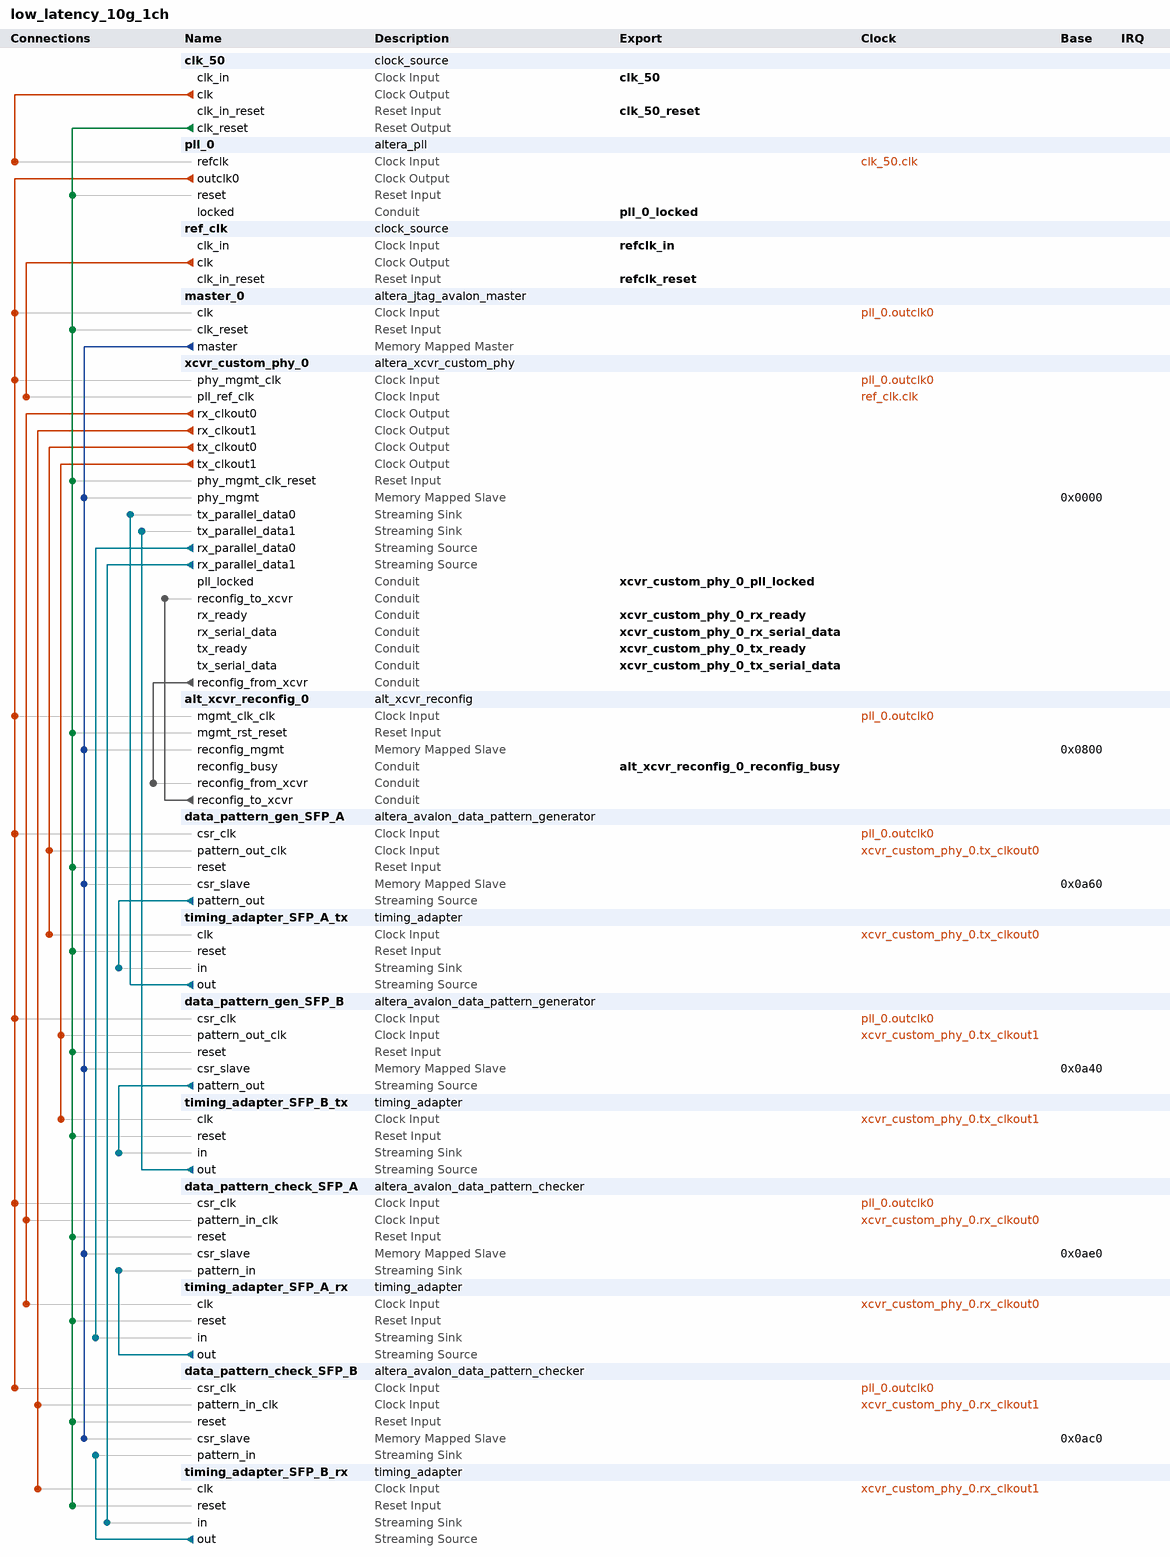
[diagram p0: system contents]
# Platform Designer (Qsys) system low_latency_10g_1ch, Arria V 5AGTFC7H3F35I3
# Parameters at their usual value, and those the tool derives, are not listed.
package require -exact qsys 17.1
create_system low_latency_10g_1ch
set_project_property DEVICE_FAMILY {Arria V}
set_project_property DEVICE 5AGTFC7H3F35I3

add_instance clk_50 clock_source 17.1
set_instance_parameter_value clk_50 clockFrequency 50000000

add_instance pll_0 altera_pll 17.1
set_instance_parameter_value pll_0 gui_device_speed_grade 1
set_instance_parameter_value pll_0 gui_number_of_clocks 1
set_instance_parameter_value pll_0 gui_operation_mode normal
set_instance_parameter_value pll_0 gui_output_clock_frequency0 100.0
set_instance_parameter_value pll_0 gui_pll_mode {Integer-N PLL}
set_instance_parameter_value pll_0 gui_reference_clock_frequency 50.0
set_instance_parameter_value pll_0 gui_use_locked true

add_instance ref_clk clock_source 17.1
set_instance_parameter_value ref_clk clockFrequency 156250000

add_instance master_0 altera_jtag_avalon_master 17.1

add_instance xcvr_custom_phy_0 altera_xcvr_custom_phy 17.1
set_instance_parameter_value xcvr_custom_phy_0 byte_order_pad_pattern 000000000
set_instance_parameter_value xcvr_custom_phy_0 byte_order_pattern 111111011
set_instance_parameter_value xcvr_custom_phy_0 channel_interface 0
set_instance_parameter_value xcvr_custom_phy_0 coreclk_0ppm_enable false
set_instance_parameter_value xcvr_custom_phy_0 data_rate 6250Mbps
set_instance_parameter_value xcvr_custom_phy_0 device_family {Arria V}
set_instance_parameter_value xcvr_custom_phy_0 en_synce_support 0
set_instance_parameter_value xcvr_custom_phy_0 gui_base_data_rate {10312.5 Mbps}
set_instance_parameter_value xcvr_custom_phy_0 gui_bonded_mode xN
set_instance_parameter_value xcvr_custom_phy_0 gui_bonding_enable false
set_instance_parameter_value xcvr_custom_phy_0 gui_byte_order_pld_ctrl_enable false
set_instance_parameter_value xcvr_custom_phy_0 gui_deser_factor 40
set_instance_parameter_value xcvr_custom_phy_0 gui_embedded_reset 1
set_instance_parameter_value xcvr_custom_phy_0 gui_enable_run_length false
set_instance_parameter_value xcvr_custom_phy_0 gui_mgmt_clk_in_hz 250000000
set_instance_parameter_value xcvr_custom_phy_0 gui_parameter_rules Custom
set_instance_parameter_value xcvr_custom_phy_0 gui_pcs_pma_width PARAM_DEFAULT
set_instance_parameter_value xcvr_custom_phy_0 gui_pll_reconfig_cdr_pll_refclk_sel 0
set_instance_parameter_value xcvr_custom_phy_0 gui_pll_reconfig_enable_pll_reconfig false
set_instance_parameter_value xcvr_custom_phy_0 gui_pll_reconfig_main_pll_index 0
set_instance_parameter_value xcvr_custom_phy_0 gui_pll_reconfig_pll0_clk_network x1
set_instance_parameter_value xcvr_custom_phy_0 gui_pll_reconfig_pll0_data_rate {0 Mbps}
set_instance_parameter_value xcvr_custom_phy_0 gui_pll_reconfig_pll0_pll_type CMU
set_instance_parameter_value xcvr_custom_phy_0 gui_pll_reconfig_pll0_refclk_freq {0 MHz}
set_instance_parameter_value xcvr_custom_phy_0 gui_pll_reconfig_pll0_refclk_sel 0
set_instance_parameter_value xcvr_custom_phy_0 gui_pll_reconfig_pll1_clk_network x1
set_instance_parameter_value xcvr_custom_phy_0 gui_pll_reconfig_pll1_data_rate {0 Mbps}
set_instance_parameter_value xcvr_custom_phy_0 gui_pll_reconfig_pll1_pll_type CMU
set_instance_parameter_value xcvr_custom_phy_0 gui_pll_reconfig_pll1_refclk_freq {0 MHz}
set_instance_parameter_value xcvr_custom_phy_0 gui_pll_reconfig_pll1_refclk_sel 0
set_instance_parameter_value xcvr_custom_phy_0 gui_pll_reconfig_pll2_clk_network x1
set_instance_parameter_value xcvr_custom_phy_0 gui_pll_reconfig_pll2_data_rate {0 Mbps}
set_instance_parameter_value xcvr_custom_phy_0 gui_pll_reconfig_pll2_pll_type CMU
set_instance_parameter_value xcvr_custom_phy_0 gui_pll_reconfig_pll2_refclk_freq {0 MHz}
set_instance_parameter_value xcvr_custom_phy_0 gui_pll_reconfig_pll2_refclk_sel 0
set_instance_parameter_value xcvr_custom_phy_0 gui_pll_reconfig_pll3_clk_network x1
set_instance_parameter_value xcvr_custom_phy_0 gui_pll_reconfig_pll3_data_rate {0 Mbps}
set_instance_parameter_value xcvr_custom_phy_0 gui_pll_reconfig_pll3_pll_type CMU
set_instance_parameter_value xcvr_custom_phy_0 gui_pll_reconfig_pll3_refclk_freq {0 MHz}
set_instance_parameter_value xcvr_custom_phy_0 gui_pll_reconfig_pll3_refclk_sel 0
set_instance_parameter_value xcvr_custom_phy_0 gui_pll_reconfig_pll_count 1
set_instance_parameter_value xcvr_custom_phy_0 gui_pll_reconfig_refclk_count 1
set_instance_parameter_value xcvr_custom_phy_0 gui_pll_refclk_freq {156.25 MHz}
set_instance_parameter_value xcvr_custom_phy_0 gui_pll_type CMU
set_instance_parameter_value xcvr_custom_phy_0 gui_pma_bonding_mode x1
set_instance_parameter_value xcvr_custom_phy_0 gui_rx_use_coreclk false
set_instance_parameter_value xcvr_custom_phy_0 gui_rx_use_recovered_clk false
set_instance_parameter_value xcvr_custom_phy_0 gui_split_interfaces 1
set_instance_parameter_value xcvr_custom_phy_0 gui_tx_bitslip_enable false
set_instance_parameter_value xcvr_custom_phy_0 gui_tx_preemp_pretap_inv false
set_instance_parameter_value xcvr_custom_phy_0 gui_tx_preemp_tap_2_inv false
set_instance_parameter_value xcvr_custom_phy_0 gui_tx_use_coreclk false
set_instance_parameter_value xcvr_custom_phy_0 gui_use_8b10b false
set_instance_parameter_value xcvr_custom_phy_0 gui_use_8b10b_manual_control false
set_instance_parameter_value xcvr_custom_phy_0 gui_use_8b10b_status false
set_instance_parameter_value xcvr_custom_phy_0 gui_use_byte_order_block false
set_instance_parameter_value xcvr_custom_phy_0 gui_use_rmfifo_status false
set_instance_parameter_value xcvr_custom_phy_0 gui_use_status false
set_instance_parameter_value xcvr_custom_phy_0 gui_use_wa_status false
set_instance_parameter_value xcvr_custom_phy_0 gxb_analog_power AUTO
set_instance_parameter_value xcvr_custom_phy_0 lanes 2
set_instance_parameter_value xcvr_custom_phy_0 operation_mode Duplex
set_instance_parameter_value xcvr_custom_phy_0 pll_external_enable 0
set_instance_parameter_value xcvr_custom_phy_0 pll_lock_speed AUTO
set_instance_parameter_value xcvr_custom_phy_0 rate_match_pattern1 11010000111010000011
set_instance_parameter_value xcvr_custom_phy_0 rate_match_pattern2 00101111000101111100
set_instance_parameter_value xcvr_custom_phy_0 run_length_violation_checking 40
set_instance_parameter_value xcvr_custom_phy_0 rx_common_mode 0.82V
set_instance_parameter_value xcvr_custom_phy_0 rx_eq_ctrl 16
set_instance_parameter_value xcvr_custom_phy_0 rx_eq_dc_gain 1
set_instance_parameter_value xcvr_custom_phy_0 rx_pll_lock_speed AUTO
set_instance_parameter_value xcvr_custom_phy_0 rx_termination OCT_100_OHMS
set_instance_parameter_value xcvr_custom_phy_0 rx_use_external_termination false
set_instance_parameter_value xcvr_custom_phy_0 std_rx_pcfifo_mode low_latency
set_instance_parameter_value xcvr_custom_phy_0 std_tx_pcfifo_mode low_latency
set_instance_parameter_value xcvr_custom_phy_0 tx_analog_power AUTO
set_instance_parameter_value xcvr_custom_phy_0 tx_common_mode 0.65V
set_instance_parameter_value xcvr_custom_phy_0 tx_preemp_pretap 0
set_instance_parameter_value xcvr_custom_phy_0 tx_preemp_tap_1 0
set_instance_parameter_value xcvr_custom_phy_0 tx_preemp_tap_2 0
set_instance_parameter_value xcvr_custom_phy_0 tx_slew_rate OFF
set_instance_parameter_value xcvr_custom_phy_0 tx_termination OCT_100_OHMS
set_instance_parameter_value xcvr_custom_phy_0 tx_use_external_termination false
set_instance_parameter_value xcvr_custom_phy_0 tx_vod_selection 2
set_instance_parameter_value xcvr_custom_phy_0 use_double_data_mode DEPRECATED
set_instance_parameter_value xcvr_custom_phy_0 use_rate_match_fifo 0
set_instance_parameter_value xcvr_custom_phy_0 word_align_pattern 11111001111111111010
set_instance_parameter_value xcvr_custom_phy_0 word_aligner_mode manual
set_instance_parameter_value xcvr_custom_phy_0 word_aligner_pattern_length 20
set_instance_parameter_value xcvr_custom_phy_0 word_aligner_state_machine_datacnt 1
set_instance_parameter_value xcvr_custom_phy_0 word_aligner_state_machine_errcnt 1
set_instance_parameter_value xcvr_custom_phy_0 word_aligner_state_machine_patterncnt 10

add_instance alt_xcvr_reconfig_0 alt_xcvr_reconfig 17.1
set_instance_parameter_value alt_xcvr_reconfig_0 device_family {Arria V}
set_instance_parameter_value alt_xcvr_reconfig_0 enable_adce 1
set_instance_parameter_value alt_xcvr_reconfig_0 enable_analog 1
set_instance_parameter_value alt_xcvr_reconfig_0 enable_dcd 1
set_instance_parameter_value alt_xcvr_reconfig_0 enable_dfe 1
set_instance_parameter_value alt_xcvr_reconfig_0 enable_eyemon 1
set_instance_parameter_value alt_xcvr_reconfig_0 number_of_reconfig_interfaces 4

add_instance data_pattern_gen_SFP_A altera_avalon_data_pattern_generator 17.1
set_instance_parameter_value data_pattern_gen_SFP_A AVALON_ENABLED true
set_instance_parameter_value data_pattern_gen_SFP_A BYPASS_ENABLED false
set_instance_parameter_value data_pattern_gen_SFP_A CROSS_CLK_SYNC_DEPTH 2
set_instance_parameter_value data_pattern_gen_SFP_A FREQ_CNTER_ENABLED false
set_instance_parameter_value data_pattern_gen_SFP_A ST_DATA_W 40

add_instance timing_adapter_SFP_A_tx timing_adapter 17.1
set_instance_parameter_value timing_adapter_SFP_A_tx inBitsPerSymbol 10
set_instance_parameter_value timing_adapter_SFP_A_tx inChannelWidth 0
set_instance_parameter_value timing_adapter_SFP_A_tx inErrorWidth 0
set_instance_parameter_value timing_adapter_SFP_A_tx inMaxChannel 0
set_instance_parameter_value timing_adapter_SFP_A_tx inReadyLatency 0
set_instance_parameter_value timing_adapter_SFP_A_tx inSymbolsPerBeat 4
set_instance_parameter_value timing_adapter_SFP_A_tx inUseEmptyPort NO
set_instance_parameter_value timing_adapter_SFP_A_tx inUsePackets false
set_instance_parameter_value timing_adapter_SFP_A_tx inUseReady true
set_instance_parameter_value timing_adapter_SFP_A_tx inUseValid true
set_instance_parameter_value timing_adapter_SFP_A_tx outReadyLatency 0
set_instance_parameter_value timing_adapter_SFP_A_tx outUseReady false
set_instance_parameter_value timing_adapter_SFP_A_tx outUseValid false

add_instance data_pattern_gen_SFP_B altera_avalon_data_pattern_generator 17.1
set_instance_parameter_value data_pattern_gen_SFP_B AVALON_ENABLED true
set_instance_parameter_value data_pattern_gen_SFP_B BYPASS_ENABLED false
set_instance_parameter_value data_pattern_gen_SFP_B CROSS_CLK_SYNC_DEPTH 2
set_instance_parameter_value data_pattern_gen_SFP_B FREQ_CNTER_ENABLED false
set_instance_parameter_value data_pattern_gen_SFP_B ST_DATA_W 40

add_instance timing_adapter_SFP_B_tx timing_adapter 17.1
set_instance_parameter_value timing_adapter_SFP_B_tx inBitsPerSymbol 10
set_instance_parameter_value timing_adapter_SFP_B_tx inChannelWidth 0
set_instance_parameter_value timing_adapter_SFP_B_tx inErrorWidth 0
set_instance_parameter_value timing_adapter_SFP_B_tx inMaxChannel 0
set_instance_parameter_value timing_adapter_SFP_B_tx inReadyLatency 0
set_instance_parameter_value timing_adapter_SFP_B_tx inSymbolsPerBeat 4
set_instance_parameter_value timing_adapter_SFP_B_tx inUseEmptyPort NO
set_instance_parameter_value timing_adapter_SFP_B_tx inUsePackets false
set_instance_parameter_value timing_adapter_SFP_B_tx inUseReady true
set_instance_parameter_value timing_adapter_SFP_B_tx inUseValid true
set_instance_parameter_value timing_adapter_SFP_B_tx outReadyLatency 0
set_instance_parameter_value timing_adapter_SFP_B_tx outUseReady false
set_instance_parameter_value timing_adapter_SFP_B_tx outUseValid false

add_instance data_pattern_check_SFP_A altera_avalon_data_pattern_checker 17.1
set_instance_parameter_value data_pattern_check_SFP_A AVALON_ENABLED true
set_instance_parameter_value data_pattern_check_SFP_A BYPASS_ENABLED false
set_instance_parameter_value data_pattern_check_SFP_A CROSS_CLK_SYNC_DEPTH 2
set_instance_parameter_value data_pattern_check_SFP_A FREQ_CNTER_ENABLED false
set_instance_parameter_value data_pattern_check_SFP_A NUM_CYCLES_FOR_LOCK 40
set_instance_parameter_value data_pattern_check_SFP_A ST_DATA_W 40

add_instance timing_adapter_SFP_A_rx timing_adapter 17.1
set_instance_parameter_value timing_adapter_SFP_A_rx inBitsPerSymbol 10
set_instance_parameter_value timing_adapter_SFP_A_rx inChannelWidth 0
set_instance_parameter_value timing_adapter_SFP_A_rx inErrorWidth 0
set_instance_parameter_value timing_adapter_SFP_A_rx inMaxChannel 0
set_instance_parameter_value timing_adapter_SFP_A_rx inReadyLatency 0
set_instance_parameter_value timing_adapter_SFP_A_rx inSymbolsPerBeat 4
set_instance_parameter_value timing_adapter_SFP_A_rx inUseEmptyPort NO
set_instance_parameter_value timing_adapter_SFP_A_rx inUsePackets false
set_instance_parameter_value timing_adapter_SFP_A_rx inUseReady false
set_instance_parameter_value timing_adapter_SFP_A_rx inUseValid false
set_instance_parameter_value timing_adapter_SFP_A_rx outReadyLatency 0
set_instance_parameter_value timing_adapter_SFP_A_rx outUseReady true
set_instance_parameter_value timing_adapter_SFP_A_rx outUseValid true

add_instance data_pattern_check_SFP_B altera_avalon_data_pattern_checker 17.1
set_instance_parameter_value data_pattern_check_SFP_B AVALON_ENABLED true
set_instance_parameter_value data_pattern_check_SFP_B BYPASS_ENABLED false
set_instance_parameter_value data_pattern_check_SFP_B CROSS_CLK_SYNC_DEPTH 2
set_instance_parameter_value data_pattern_check_SFP_B FREQ_CNTER_ENABLED false
set_instance_parameter_value data_pattern_check_SFP_B NUM_CYCLES_FOR_LOCK 40
set_instance_parameter_value data_pattern_check_SFP_B ST_DATA_W 40

add_instance timing_adapter_SFP_B_rx timing_adapter 17.1
set_instance_parameter_value timing_adapter_SFP_B_rx inBitsPerSymbol 10
set_instance_parameter_value timing_adapter_SFP_B_rx inChannelWidth 0
set_instance_parameter_value timing_adapter_SFP_B_rx inErrorWidth 0
set_instance_parameter_value timing_adapter_SFP_B_rx inMaxChannel 0
set_instance_parameter_value timing_adapter_SFP_B_rx inReadyLatency 0
set_instance_parameter_value timing_adapter_SFP_B_rx inSymbolsPerBeat 4
set_instance_parameter_value timing_adapter_SFP_B_rx inUseEmptyPort NO
set_instance_parameter_value timing_adapter_SFP_B_rx inUsePackets false
set_instance_parameter_value timing_adapter_SFP_B_rx inUseReady false
set_instance_parameter_value timing_adapter_SFP_B_rx inUseValid false
set_instance_parameter_value timing_adapter_SFP_B_rx outReadyLatency 0
set_instance_parameter_value timing_adapter_SFP_B_rx outUseReady true
set_instance_parameter_value timing_adapter_SFP_B_rx outUseValid true

# connections
add_connection clk_50.clk pll_0.refclk clock
add_connection pll_0.outclk0 alt_xcvr_reconfig_0.mgmt_clk_clk clock
add_connection pll_0.outclk0 data_pattern_check_SFP_A.csr_clk clock
add_connection pll_0.outclk0 data_pattern_check_SFP_B.csr_clk clock
add_connection pll_0.outclk0 data_pattern_gen_SFP_A.csr_clk clock
add_connection pll_0.outclk0 data_pattern_gen_SFP_B.csr_clk clock
add_connection pll_0.outclk0 master_0.clk clock
add_connection pll_0.outclk0 xcvr_custom_phy_0.phy_mgmt_clk clock
add_connection ref_clk.clk xcvr_custom_phy_0.pll_ref_clk clock
add_connection xcvr_custom_phy_0.rx_clkout0 data_pattern_check_SFP_A.pattern_in_clk clock
add_connection xcvr_custom_phy_0.rx_clkout0 timing_adapter_SFP_A_rx.clk clock
add_connection xcvr_custom_phy_0.rx_clkout1 data_pattern_check_SFP_B.pattern_in_clk clock
add_connection xcvr_custom_phy_0.rx_clkout1 timing_adapter_SFP_B_rx.clk clock
add_connection xcvr_custom_phy_0.tx_clkout0 data_pattern_gen_SFP_A.pattern_out_clk clock
add_connection xcvr_custom_phy_0.tx_clkout0 timing_adapter_SFP_A_tx.clk clock
add_connection xcvr_custom_phy_0.tx_clkout1 data_pattern_gen_SFP_B.pattern_out_clk clock
add_connection xcvr_custom_phy_0.tx_clkout1 timing_adapter_SFP_B_tx.clk clock
add_connection clk_50.clk_reset alt_xcvr_reconfig_0.mgmt_rst_reset reset
add_connection clk_50.clk_reset data_pattern_check_SFP_A.reset reset
add_connection clk_50.clk_reset data_pattern_check_SFP_B.reset reset
add_connection clk_50.clk_reset data_pattern_gen_SFP_A.reset reset
add_connection clk_50.clk_reset data_pattern_gen_SFP_B.reset reset
add_connection clk_50.clk_reset master_0.clk_reset reset
add_connection clk_50.clk_reset pll_0.reset reset
add_connection clk_50.clk_reset timing_adapter_SFP_A_rx.reset reset
add_connection clk_50.clk_reset timing_adapter_SFP_A_tx.reset reset
add_connection clk_50.clk_reset timing_adapter_SFP_B_rx.reset reset
add_connection clk_50.clk_reset timing_adapter_SFP_B_tx.reset reset
add_connection clk_50.clk_reset xcvr_custom_phy_0.phy_mgmt_clk_reset reset
add_connection master_0.master alt_xcvr_reconfig_0.reconfig_mgmt avalon
set_connection_parameter_value master_0.master/alt_xcvr_reconfig_0.reconfig_mgmt baseAddress 0x0800
add_connection master_0.master data_pattern_check_SFP_A.csr_slave avalon
set_connection_parameter_value master_0.master/data_pattern_check_SFP_A.csr_slave baseAddress 0x0ae0
add_connection master_0.master data_pattern_check_SFP_B.csr_slave avalon
set_connection_parameter_value master_0.master/data_pattern_check_SFP_B.csr_slave baseAddress 0x0ac0
add_connection master_0.master data_pattern_gen_SFP_A.csr_slave avalon
set_connection_parameter_value master_0.master/data_pattern_gen_SFP_A.csr_slave baseAddress 0x0a60
add_connection master_0.master data_pattern_gen_SFP_B.csr_slave avalon
set_connection_parameter_value master_0.master/data_pattern_gen_SFP_B.csr_slave baseAddress 0x0a40
add_connection master_0.master xcvr_custom_phy_0.phy_mgmt avalon
set_connection_parameter_value master_0.master/xcvr_custom_phy_0.phy_mgmt baseAddress 0x0000
add_connection data_pattern_gen_SFP_A.pattern_out timing_adapter_SFP_A_tx.in avalon_streaming
add_connection data_pattern_gen_SFP_B.pattern_out timing_adapter_SFP_B_tx.in avalon_streaming
add_connection timing_adapter_SFP_A_rx.out data_pattern_check_SFP_A.pattern_in avalon_streaming
add_connection timing_adapter_SFP_A_tx.out xcvr_custom_phy_0.tx_parallel_data0 avalon_streaming
add_connection timing_adapter_SFP_B_rx.out data_pattern_check_SFP_B.pattern_in avalon_streaming
add_connection timing_adapter_SFP_B_tx.out xcvr_custom_phy_0.tx_parallel_data1 avalon_streaming
add_connection xcvr_custom_phy_0.rx_parallel_data0 timing_adapter_SFP_A_rx.in avalon_streaming
add_connection xcvr_custom_phy_0.rx_parallel_data1 timing_adapter_SFP_B_rx.in avalon_streaming
add_connection alt_xcvr_reconfig_0.reconfig_to_xcvr xcvr_custom_phy_0.reconfig_to_xcvr conduit
add_connection xcvr_custom_phy_0.reconfig_from_xcvr alt_xcvr_reconfig_0.reconfig_from_xcvr conduit

# exported interfaces
add_interface alt_xcvr_reconfig_0_reconfig_busy conduit end
set_interface_property alt_xcvr_reconfig_0_reconfig_busy EXPORT_OF alt_xcvr_reconfig_0.reconfig_busy
add_interface clk_50 clock sink
set_interface_property clk_50 EXPORT_OF clk_50.clk_in
add_interface clk_50_reset reset sink
set_interface_property clk_50_reset EXPORT_OF clk_50.clk_in_reset
add_interface pll_0_locked conduit end
set_interface_property pll_0_locked EXPORT_OF pll_0.locked
add_interface refclk_in clock sink
set_interface_property refclk_in EXPORT_OF ref_clk.clk_in
add_interface refclk_reset reset sink
set_interface_property refclk_reset EXPORT_OF ref_clk.clk_in_reset
add_interface xcvr_custom_phy_0_pll_locked conduit end
set_interface_property xcvr_custom_phy_0_pll_locked EXPORT_OF xcvr_custom_phy_0.pll_locked
add_interface xcvr_custom_phy_0_rx_ready conduit end
set_interface_property xcvr_custom_phy_0_rx_ready EXPORT_OF xcvr_custom_phy_0.rx_ready
add_interface xcvr_custom_phy_0_rx_serial_data conduit end
set_interface_property xcvr_custom_phy_0_rx_serial_data EXPORT_OF xcvr_custom_phy_0.rx_serial_data
add_interface xcvr_custom_phy_0_tx_ready conduit end
set_interface_property xcvr_custom_phy_0_tx_ready EXPORT_OF xcvr_custom_phy_0.tx_ready
add_interface xcvr_custom_phy_0_tx_serial_data conduit end
set_interface_property xcvr_custom_phy_0_tx_serial_data EXPORT_OF xcvr_custom_phy_0.tx_serial_data

set_interconnect_requirement {$system} qsys_mm.clockCrossingAdapter HANDSHAKE
set_interconnect_requirement {$system} qsys_mm.maxAdditionalLatency 1

save_system low_latency_10g_1ch.qsys
